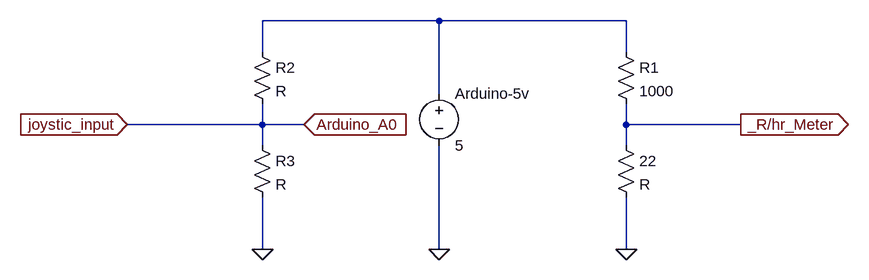
[diagram p0: schematic Rough Spice Model.asc]
Rough Spice Model.asc, the LTspice schematic file:
Version 4
SHEET 1 880 680
WIRE -16 -64 -288 -64
WIRE 272 -64 -16 -64
WIRE -288 -16 -288 -64
WIRE 272 -16 272 -64
WIRE -16 48 -16 -64
WIRE -288 96 -288 64
WIRE -288 96 -496 96
WIRE -224 96 -288 96
WIRE 272 96 272 64
WIRE 448 96 272 96
WIRE -288 128 -288 96
WIRE 272 128 272 96
WIRE -288 288 -288 208
WIRE -16 288 -16 128
WIRE 272 288 272 208
FLAG 272 288 0
FLAG -16 288 0
FLAG 448 96 _R/hr_Meter
IOPIN 448 96 Out
FLAG -288 288 0
FLAG -496 96 joystic_input
IOPIN -496 96 In
FLAG -224 96 Arduino_A0
IOPIN -224 96 In
SYMBOL res 256 -32 R0
SYMATTR InstName R1
SYMATTR Value 1000
SYMBOL res 256 112 R0
SYMATTR InstName 22
SYMBOL voltage -16 32 R0
SYMATTR InstName Arduino-5v
SYMATTR Value 5
SYMBOL res -304 -32 R0
SYMATTR InstName R2
SYMBOL res -304 112 R0
SYMATTR InstName R3

The netlist it stands for:
* Rough Spice Model.asc
R1 N001 _R/hr_Meter 1000
R§22 _R/hr_Meter 0 R
V§Arduino-5v N001 0 5
R2 N001 Arduino_A0 R
R3 Arduino_A0 0 R
.backanno
.end